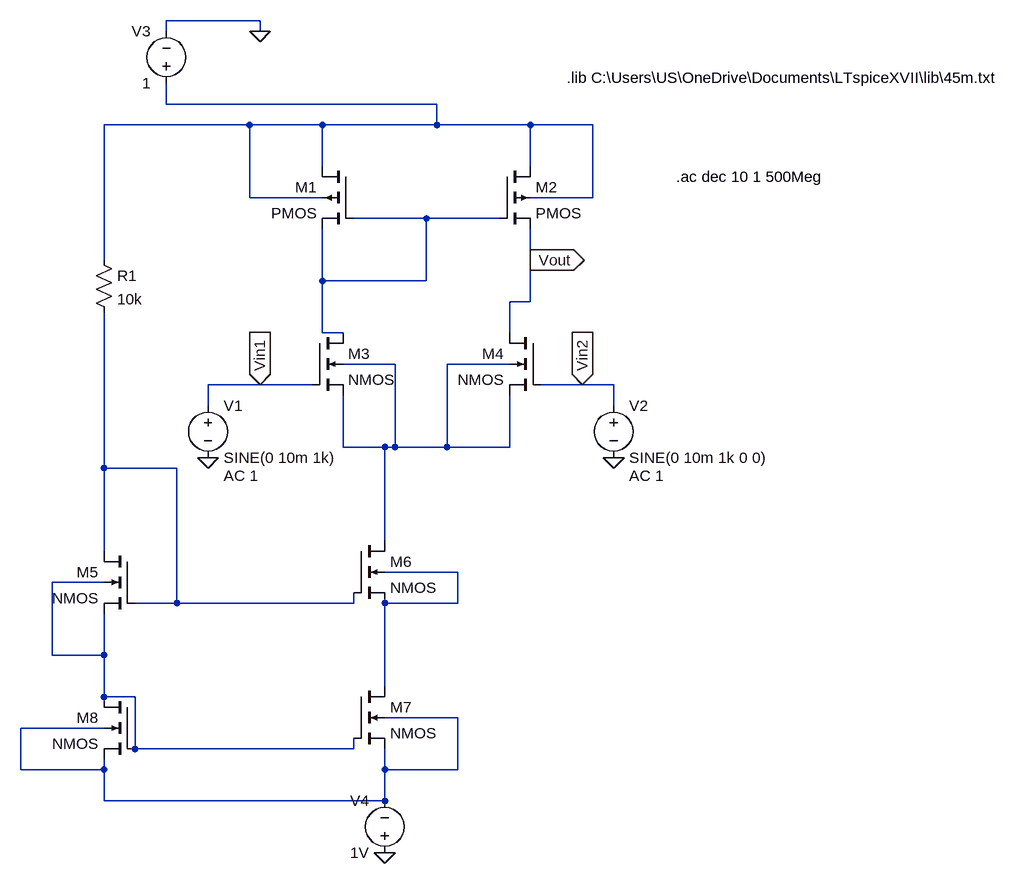
[diagram p0: schematic Cascode amp.asc]
Cascode amp.asc, the LTspice schematic file:
Version 4
SHEET 1 1368 980
WIRE -176 -480 -320 -480
WIRE -320 -464 -320 -480
WIRE -176 -464 -176 -480
WIRE -320 -352 -320 -384
WIRE 96 -352 -320 -352
WIRE -192 -320 -416 -320
WIRE -80 -320 -192 -320
WIRE 96 -320 96 -352
WIRE 96 -320 -80 -320
WIRE 240 -320 96 -320
WIRE 336 -320 240 -320
WIRE -80 -256 -80 -320
WIRE 240 -256 240 -320
WIRE -192 -208 -192 -320
WIRE -80 -208 -192 -208
WIRE 336 -208 336 -320
WIRE 336 -208 240 -208
WIRE 80 -176 -32 -176
WIRE 192 -176 80 -176
WIRE -416 -112 -416 -320
WIRE 240 -112 240 -160
WIRE -80 -80 -80 -160
WIRE 80 -80 80 -176
WIRE 80 -80 -80 -80
WIRE 240 -48 240 -112
WIRE 240 -48 208 -48
WIRE -80 0 -80 -80
WIRE -48 0 -80 0
WIRE 208 0 208 -48
WIRE 32 48 -48 48
WIRE 208 48 112 48
WIRE -176 80 -256 80
WIRE -96 80 -176 80
WIRE 320 80 256 80
WIRE 368 80 320 80
WIRE -256 112 -256 80
WIRE 368 112 368 80
WIRE -48 176 -48 96
WIRE 16 176 -48 176
WIRE 32 176 32 48
WIRE 32 176 16 176
WIRE 112 176 112 48
WIRE 112 176 32 176
WIRE 208 176 208 96
WIRE 208 176 112 176
WIRE -416 208 -416 -32
WIRE -304 208 -416 208
WIRE 16 320 16 176
WIRE -416 336 -416 208
WIRE 128 368 16 368
WIRE -416 384 -496 384
WIRE -304 416 -304 208
WIRE -304 416 -368 416
WIRE -32 416 -32 400
WIRE -32 416 -304 416
WIRE 128 416 128 368
WIRE 128 416 16 416
WIRE -496 496 -496 384
WIRE -416 496 -416 432
WIRE -416 496 -496 496
WIRE 16 544 16 416
WIRE -416 560 -416 496
WIRE -368 560 -416 560
WIRE 128 592 16 592
WIRE -416 608 -544 608
WIRE -368 640 -368 560
WIRE -32 640 -32 624
WIRE -32 640 -368 640
WIRE -544 672 -544 608
WIRE -416 672 -416 656
WIRE -416 672 -544 672
WIRE 16 672 16 640
WIRE 128 672 128 592
WIRE 128 672 16 672
WIRE -416 720 -416 672
WIRE 16 720 16 672
WIRE 16 720 -416 720
FLAG -256 192 0
FLAG 368 192 0
FLAG 16 800 0
FLAG -176 80 Vin1
IOPIN -176 80 In
FLAG 320 80 Vin2
IOPIN 320 80 In
FLAG -176 -464 0
FLAG 240 -112 Vout
IOPIN 240 -112 Out
SYMBOL voltage -256 96 R0
WINDOW 123 24 124 Left 2
WINDOW 39 0 0 Left 0
SYMATTR Value2 AC 1
SYMATTR InstName V1
SYMATTR Value SINE(0 10m 1k)
SYMBOL voltage 368 96 R0
WINDOW 123 24 124 Left 2
WINDOW 39 0 0 Left 0
SYMATTR Value2 AC 1
SYMATTR InstName V2
SYMATTR Value SINE(0 10m 1k 0 0)
SYMBOL voltage -320 -368 R180
WINDOW 0 24 96 Left 2
WINDOW 3 24 16 Left 2
WINDOW 123 0 0 Left 0
WINDOW 39 0 0 Left 0
SYMATTR InstName V3
SYMATTR Value 1
SYMBOL voltage 16 816 R180
WINDOW 0 24 96 Left 2
WINDOW 3 24 16 Left 2
WINDOW 123 0 0 Left 0
WINDOW 39 0 0 Left 0
SYMATTR InstName V4
SYMATTR Value 1V
SYMBOL res -432 -128 R0
SYMATTR InstName R1
SYMATTR Value 10k
SYMBOL nmos4 -96 0 R0
SYMATTR InstName M3
SYMATTR Value2 l=500n w=3u
SYMBOL nmos4 256 0 M0
SYMATTR InstName M4
SYMATTR Value2 l=500n w=3u
SYMBOL nmos4 -32 320 R0
SYMATTR InstName M6
SYMATTR Value2 l=500n w=6u
SYMBOL nmos4 -368 336 M0
SYMATTR InstName M5
SYMATTR Value2 l=500n w=6u
SYMBOL pmos4 -32 -256 M0
SYMATTR InstName M1
SYMATTR Value2 l=500n w=9u
SYMBOL pmos4 192 -256 R0
SYMATTR InstName M2
SYMATTR Value2 l=500n w=9u
SYMBOL nmos4 -32 544 R0
SYMATTR InstName M7
SYMATTR Value2 l=500n w=6u
SYMBOL nmos4 -368 560 M0
SYMATTR InstName M8
SYMATTR Value2 l=500n w=6u
TEXT 296 -392 Left 2 !.lib C:\\Users\\US\\OneDrive\\Documents\\LTspiceXVII\\lib\\45m.txt
TEXT 464 -240 Left 2 !.ac dec 10 1 500Meg

The netlist it stands for:
* Cascode amp.asc
V1 Vin1 0 SINE(0 10m 1k) AC 1
V2 Vin2 0 SINE(0 10m 1k 0 0) AC 1
V3 N001 0 1
V4 0 N007 1V
R1 N001 N004 10k
M3 N002 Vin1 N003 N003 NMOS l=500n w=3u
M4 Vout Vin2 N003 N003 NMOS l=500n w=3u
M6 N003 N004 N005 N005 NMOS l=500n w=6u
M5 N004 N004 N006 N006 NMOS l=500n w=6u
M1 N001 N002 N002 N001 PMOS l=500n w=9u
M2 N001 N002 Vout N001 PMOS l=500n w=9u
M7 N005 N006 N007 N007 NMOS l=500n w=6u
M8 N006 N006 N007 N007 NMOS l=500n w=6u
.model NMOS NMOS
.model PMOS PMOS
.lib standard.mos
.lib C:\Users\US\OneDrive\Documents\LTspiceXVII\lib\45m.txt
.ac dec 10 1 500Meg
.backanno
.end